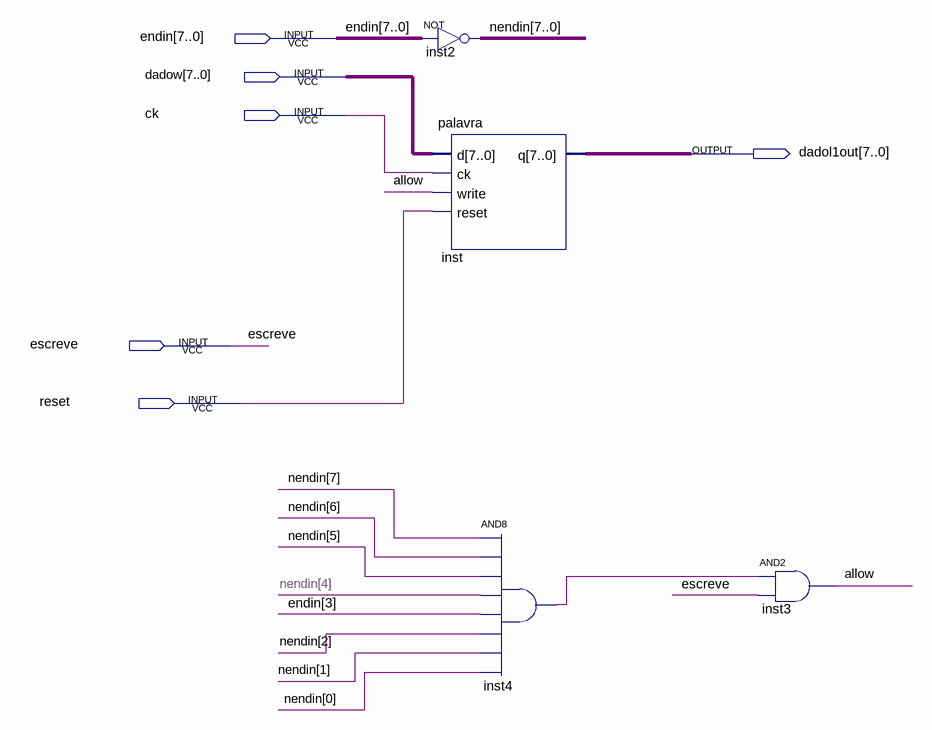
[diagram p0: schematic sheet]
// Quartus schematic endereco.bdf as structural Verilog: 4 symbols, 6 pins
module endereco (
  input  [7:0] endin,
  input  [7:0] dadow,
  input  ck,
  input  escreve,
  input  reset,
  output [7:0] dadol1out
);

  wire allow, inst4_out;
  wire [7:0] nendin;

  assign nendin = ~endin;  // NOT inst2, 8 bits wide
  palavra inst (.d(dadow), .ck(ck), .write(allow), .reset(reset), .q(dadol1out));
  and inst4 (inst4_out, nendin[7], nendin[6], nendin[5], nendin[4], endin[3], nendin[2], nendin[1], nendin[0]);
  and inst3 (allow, inst4_out, escreve);
endmodule
